# Altium schematic sheet 7SegSplitter.SchDoc: LiveDesign Evaluation - Alarm Clock
size A4; Organization: Altium Limited; Address1: L3, 12a Rodborough Rd; Address2: Frenchs Forest; Address3: NSW; Address4: Australia 2086; DocumentNumber: 6; SheetNumber: 6; SheetTotal: 10
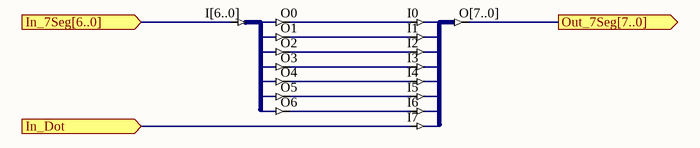
[diagram p0: 7SegSplitter.SchDoc]

## Parts
U110  J8S_8B  (value not drawn)
U111  J7B_7S  (value not drawn)

## Ports
In_7Seg[6..0] (in), In_Dot (in), Out_7Seg[7..0] (out)

## Nets
In_7Seg[6..0]: U111.I[6..0] ; port In_7Seg[6..0]
In_Dot: U110.I7 ; port In_Dot
Out_7Seg[7..0]: U110.O[7..0] ; port Out_7Seg[7..0]
NetU110_I0: U110.I0 U111.O0
NetU110_I1: U110.I1 U111.O1
NetU110_I2: U110.I2 U111.O2
NetU110_I3: U110.I3 U111.O3
NetU110_I4: U110.I4 U111.O4
NetU110_I5: U110.I5 U111.O5
NetU110_I6: U110.I6 U111.O6

## Notes on the sheet
- Title
- Size:
- Date:
- A4
- Number:
- Time:
- Revision:
- Sheet
- of
- File:

## Library data of the parts
U110 = J8S_8B: 8 Single pin inputs to single 8-Bit output bus; ArchiveName: GENERIC; VHDLIB_SIM: GENERIC_LIB; Published: 29-Jan-2004; Publisher: Altium Limited; Core Revision: 1.00.00
U111 = J7B_7S: 7-Bit input bus to 7 Single pin outputs; ArchiveName: GENERIC; VHDLIB_SIM: GENERIC_LIB; Published: 29-Jan-2004; Publisher: Altium Limited; Core Revision: 1.00.00